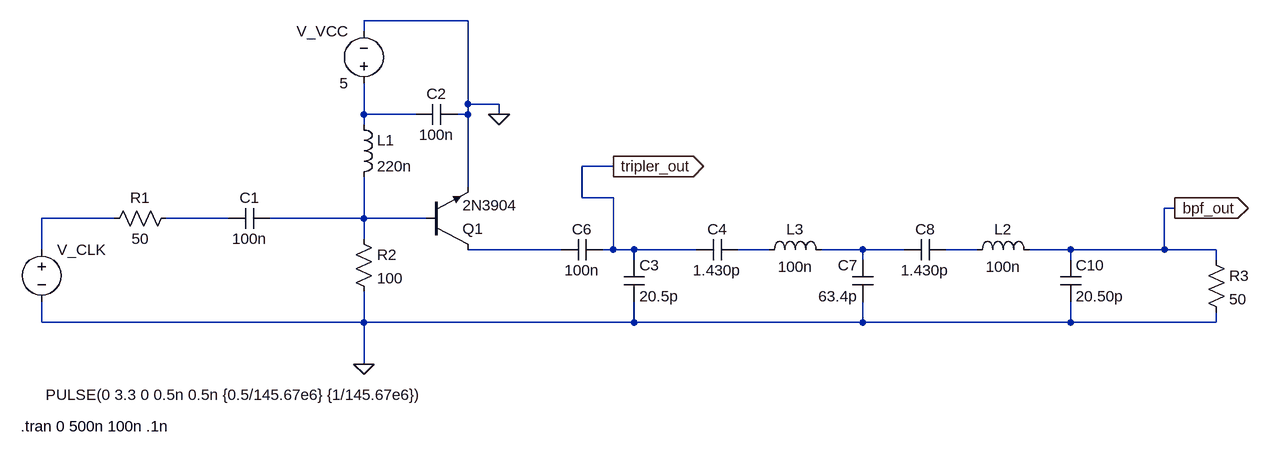
[diagram p0: schematic tripler_with_BPF_v03_2N3904.asc]
tripler_with_BPF_v03_2N3904.asc, the LTspice schematic file:
Version 4.1
SHEET 1 1688 680
WIRE 448 -96 288 -96
WIRE 288 -80 288 -96
WIRE 448 32 448 -96
WIRE 496 32 448 32
WIRE 288 48 288 0
WIRE 368 48 288 48
WIRE 448 48 448 32
WIRE 448 48 432 48
WIRE 496 48 496 32
WIRE 288 64 288 48
WIRE 672 128 624 128
WIRE 448 160 448 48
WIRE 624 176 624 128
WIRE 672 176 624 176
WIRE 1536 192 1520 192
WIRE -96 208 -208 208
WIRE 80 208 -16 208
WIRE 288 208 288 144
WIRE 288 208 144 208
WIRE 384 208 288 208
WIRE 288 240 288 208
WIRE -208 256 -208 208
WIRE 592 256 448 256
WIRE 672 256 672 176
WIRE 672 256 656 256
WIRE 704 256 672 256
WIRE 800 256 704 256
WIRE 912 256 864 256
WIRE 1056 256 992 256
WIRE 1120 256 1056 256
WIRE 1232 256 1184 256
WIRE 1376 256 1312 256
WIRE 1520 256 1520 192
WIRE 1520 256 1376 256
WIRE 1600 256 1520 256
WIRE 704 272 704 256
WIRE 1056 272 1056 256
WIRE 1376 272 1376 256
WIRE 1600 272 1600 256
WIRE -208 368 -208 336
WIRE 288 368 288 320
WIRE 288 368 -208 368
WIRE 704 368 704 336
WIRE 704 368 288 368
WIRE 1056 368 1056 336
WIRE 1056 368 704 368
WIRE 1376 368 1376 336
WIRE 1376 368 1056 368
WIRE 1600 368 1600 352
WIRE 1600 368 1376 368
WIRE 288 432 288 368
FLAG 496 48 0
FLAG 288 432 0
FLAG 672 128 tripler_out
IOPIN 672 128 Out
FLAG 1536 192 bpf_out
IOPIN 1536 192 Out
SYMBOL voltage -208 240 R0
WINDOW 3 6 239 Left 2
WINDOW 123 0 0 Left 0
WINDOW 39 0 0 Left 0
SYMATTR Value PULSE(0 3.3 0 0.5n 0.5n {0.5/145.67e6} {1/145.67e6})
SYMATTR InstName V_CLK
SYMBOL res 0 192 R90
WINDOW 0 0 56 VBottom 2
WINDOW 3 32 56 VTop 2
SYMATTR InstName R1
SYMATTR Value 50
SYMBOL cap 144 192 R90
WINDOW 0 0 32 VBottom 2
WINDOW 3 32 32 VTop 2
SYMATTR InstName C1
SYMATTR Value 100n
SYMBOL voltage 288 16 R180
WINDOW 0 24 96 Left 2
WINDOW 3 24 16 Left 2
WINDOW 123 0 0 Left 0
WINDOW 39 0 0 Left 0
SYMATTR InstName V_VCC
SYMATTR Value 5
SYMBOL ind 272 48 R0
SYMATTR InstName L1
SYMATTR Value 220n
SYMBOL res 272 224 R0
SYMATTR InstName R2
SYMATTR Value 100
SYMBOL cap 432 32 R90
WINDOW 0 0 32 VBottom 2
WINDOW 3 32 32 VTop 2
SYMATTR InstName C2
SYMATTR Value 100n
SYMBOL npn 384 256 M180
SYMATTR InstName Q1
SYMATTR Value 2N3904
SYMATTR Prefix Q
SYMBOL res 1584 256 R0
SYMATTR InstName R3
SYMATTR Value 50
SYMBOL cap 656 240 R90
WINDOW 0 0 32 VBottom 2
WINDOW 3 32 32 VTop 2
SYMATTR InstName C6
SYMATTR Value 100n
SYMBOL cap 688 272 R0
SYMATTR InstName C3
SYMATTR Value 20.5p
SYMBOL cap 864 240 R90
WINDOW 0 0 32 VBottom 2
WINDOW 3 32 32 VTop 2
SYMATTR InstName C4
SYMATTR Value 1.430p
SYMBOL cap 1072 336 R180
WINDOW 0 24 56 Left 2
WINDOW 3 24 8 Left 2
SYMATTR InstName C7
SYMATTR Value 63.4p
SYMBOL cap 1120 272 R270
WINDOW 0 32 32 VTop 2
WINDOW 3 0 32 VBottom 2
SYMATTR InstName C8
SYMATTR Value 1.430p
SYMBOL cap 1360 272 R0
SYMATTR InstName C10
SYMATTR Value 20.50p
SYMBOL ind 1216 272 R270
WINDOW 0 32 56 VTop 2
WINDOW 3 5 56 VBottom 2
SYMATTR InstName L2
SYMATTR Value 100n
SYMBOL ind 896 272 R270
WINDOW 0 32 56 VTop 2
WINDOW 3 5 56 VBottom 2
SYMATTR InstName L3
SYMATTR Value 100n
TEXT -240 528 Left 2 !.tran 0 500n 100n .1n

The netlist it stands for:
* tripler_with_BPF_v03_2N3904.asc
V_CLK N002 0 PULSE(0 3.3 0 0.5n 0.5n {0.5/145.67e6} {1/145.67e6})
R1 N003 N002 50
C1 N004 N003 100n
V_VCC N001 0 5
L1 N001 N004 220n
R2 N004 0 100
C2 0 N001 100n
Q1 N005 N004 0 0 2N3904
R3 bpf_out 0 50
C6 tripler_out N005 100n
C3 tripler_out 0 20.5p
C4 N006 tripler_out 1.430p
C7 0 N007 63.4p
C8 N007 N008 1.430p
C10 bpf_out 0 20.50p
L2 N008 bpf_out 100n
L3 N006 N007 100n
.model NPN NPN
.model PNP PNP
.lib standard.bjt
.tran 0 500n 100n .1n
.backanno
.end